# Altium schematic sheet Relays.SchDoc
size A
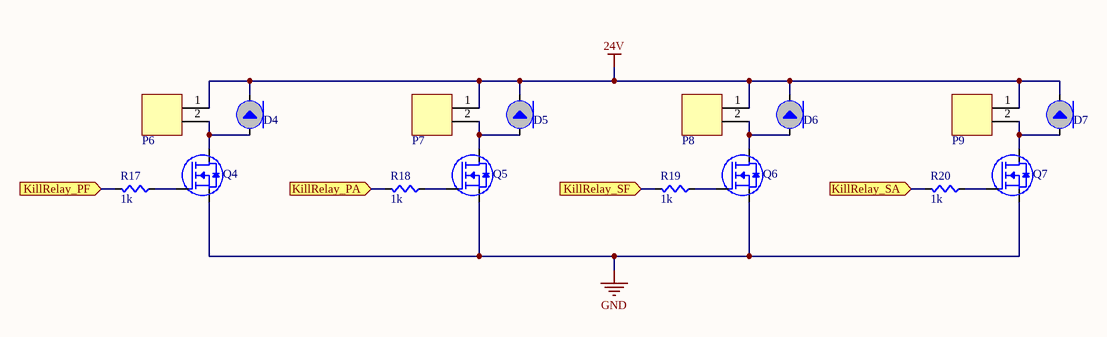
[diagram p0: Relays.SchDoc]

## Parts
D4  S1B-13-F  [SMASeries]  (value not drawn)
D5  S1B-13-F  [SMASeries]  (value not drawn)
D6  S1B-13-F  [SMASeries]  (value not drawn)
D7  S1B-13-F  [SMASeries]  (value not drawn)
P6  2-pin Horz Sherlock  [MOLEX-HDR-1X2-SHERLOCK-HORZ]  (value not drawn)
P7  2-pin Horz Sherlock  [MOLEX-HDR-1X2-SHERLOCK-HORZ]  (value not drawn)
P8  2-pin Horz Sherlock  [MOLEX-HDR-1X2-SHERLOCK-HORZ]  (value not drawn)
P9  2-pin Horz Sherlock  [MOLEX-HDR-1X2-SHERLOCK-HORZ]  (value not drawn)
Q4  BSN20-7  [SOT-323]  (value not drawn)
Q5  BSN20-7  [SOT-323]  (value not drawn)
Q6  BSN20-7  [SOT-323]  (value not drawn)
Q7  BSN20-7  [SOT-323]  (value not drawn)
R17  value 1k  [RES0603]  (hidden comment: Res)
R18  value 1k  [RES0603]  (hidden comment: Res)
R19  value 1k  [RES0603]  (hidden comment: Res)
R20  value 1k  [RES0603]  (hidden comment: Res)

## Ports
KillRelay_PA (in), KillRelay_PF (in), KillRelay_SA (in), KillRelay_SF (in)

## Nets
24V: D4.C D5.C D6.C D7.C P6.1 P7.1 P8.1 P9.1
GND: Q4.2(S) Q5.2(S) Q6.2(S) Q7.2(S)
KillRelay_PA: R18.1(A) ; port KillRelay_PA
KillRelay_PF: R17.1(A) ; port KillRelay_PF
KillRelay_SA: R20.1(A) ; port KillRelay_SA
KillRelay_SF: R19.1(A) ; port KillRelay_SF
NetD4_A: D4.A P6.2 Q4.3(D)
NetD5_A: D5.A P7.2 Q5.3(D)
NetD6_A: D6.A P8.2 Q6.3(D)
NetD7_A: D7.A P9.2 Q7.3(D)
NetQ4_1: Q4.1(G) R17.2(B)
NetQ5_1: Q5.1(G) R18.2(B)
NetQ6_1: Q6.1(G) R19.2(B)
NetQ7_1: Q7.1(G) R20.2(B)

## Library data of the parts
D4-D7 = Diode: Standard Diode Template; Supplier 1: Digi-Key; Supplier Part Number 1: S1B-FDICT-ND
P6-P9 = MOLEX-HDR-1x2-SHERLOCK_RA: Header, Molex, 2mm Pitch Sherlock Header, Single Row, Horizontal, 2 Circuits, Length 3.3mm,  0353630260; Manufacturer: Molex Inc; Manufacturer Part Number: 0353630260; Supplier Part Number 1: WM18931-ND; Supplier 1: Digi-Key
Q4-Q7 = NMOSFET: NMOSFET Template; Supplier 1: Digi-Key; Supplier Part Number 1: BSN20-7DICT-ND
R17-R20 = Res: Supplier 1: Digi-Key; Supplier Part Number 1: RMCF0603JT10K0CT-ND